# Altium schematic sheet Comparator.SchDoc
size A
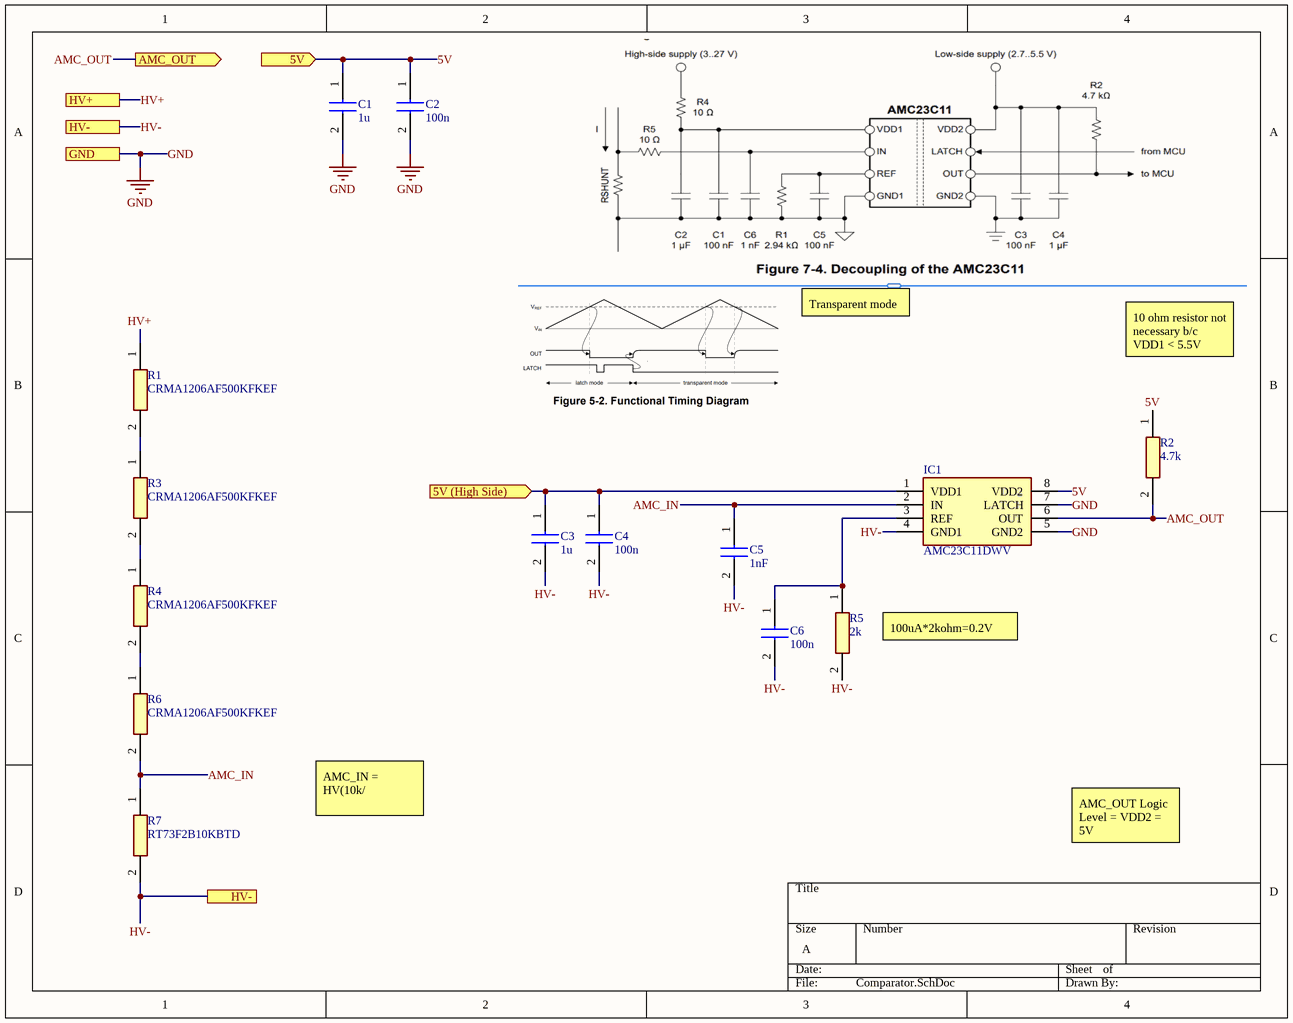
[diagram p0: Comparator.SchDoc]

## Parts
C1  1u  [CAPC2012X145N]
C2  100n  [CAPC2012X147N]
C3  1u  [CAPC2012X145N]
C4  100n  [CAPC2012X147N]
C5  1nF  [C1210]
C6  100n  [CAPC2012X147N]
IC1  AMC23C11DWV  [SOIC127P1150X280-8N]
R1  CRMA1206AF500KFKEF  [RESC3216X74N]
R2  4.7k  [RESC2012X65N]
R3  CRMA1206AF500KFKEF  [RESC3216X74N]
R4  CRMA1206AF500KFKEF  [RESC3216X74N]
R5  2k  [ERJP06D1000V]
R6  CRMA1206AF500KFKEF  [RESC3216X74N]
R7  RT73F2B10KBTD  [RESC3216X70N]

## Ports
5V (High Side) (in), 5V (in), AMC_OUT (out), GND, HV+, HV-

## Nets
GND: C1.2 C2.2 IC1.5(GND2) IC1.7(LATCH) ; port GND
5V: C1.1 C2.1 IC1.8(VDD2) R2.1 ; port 5V
5V (High Side): C3.1 C4.1 IC1.1(VDD1) ; port 5V (High Side)
AMC_IN: C5.1 IC1.2(IN) R6.2 R7.1
AMC_OUT: IC1.6(OUT) R2.2 ; port AMC_OUT
HV+: R1.1 ; port HV+
HV-: C3.2 C4.2 C5.2 C6.2 IC1.4(GND1) R5.2 R7.2 ; port HV-
NetC6_1: C6.1 IC1.3(REF) R5.1
NetR1_2: R1.2 R3.1
NetR3_2: R3.2 R4.1
NetR4_2: R4.2 R6.1

## Notes on the sheet
- Transparent mode
- 10 ohm resistor not necessary b/c VDD1 < 5.5V
- (near R5) 100uA*2kohm=0.2V
- AMC_IN = HV(10k/
- AMC_OUT Logic Level = VDD2 = 5V

## Library data of the parts
C1 C3 = KGM21AV51H105ZU: Capacitor; Manufacturer_Name: Kyocera AVX; Datasheet Link: https://www.mouser.com/datasheet/2/40/KGM_Y5V-3223189.pdf; Height: 1.45mm; Manufacturer_Part_Number: KGM21AV51H105ZU
C2 C4 C6 = KGF21BR71H104KT: Capacitor; Manufacturer_Name: Kyocera AVX; Datasheet Link: https://www.mouser.fr/datasheet/2/40/KGF-3223650.pdf; Height: 1.47mm; Manufacturer_Part_Number: KGF21BR71H104KT; Mouser Part Number: 581-KGF21BR71H104KT; Mouser Price/Stock: https://www.mouser.co.uk/ProductDetail/KYOCERA-AVX/KGF21BR71H104KT?qs=Jm2GQyTW%2FbjYyKCvVWAEOw%3D%3D; Arrow Part Number: KGF21BR71H104KT; Arrow Price/Stock: https://www.arrow.com/en/products/kgf21br71h104kt/avx?utm_currency=USD&region=nac
C5 = C1210C102JDGACAUTO: Capacitor; Manufacturer_Name: Yageo Group; Datasheet Link: https://www.yageogroup.com/content/datasheet/asset/file/KEM_C1080_C0G_HV_AUTO_SMD; Manufacturer_Part_Number: C1210C102JDGACAUTO; Mouser Part Number: 80-C1210C102JDGAUTO; Mouser Price/Stock: https://www.mouser.co.uk/ProductDetail/KEMET/C1210C102JDGACAUTO?qs=f9yNj16SXrIz1%252BjZlRLS%2FQ%3D%3D
IC1 = AMC23C11DWV: Integrated Circuit; Manufacturer_Name: Texas Instruments; Datasheet Link: https://www.ti.com/lit/ds/symlink/amc23c11.pdf; Height: 2.8mm; Manufacturer_Part_Number: AMC23C11DWV; Mouser Part Number: 595-AMC23C11DWV; Mouser Price/Stock: https://www.mouser.co.uk/ProductDetail/Texas-Instruments/AMC23C11DWV?qs=By6Nw2ByBD0b%2FD7l%2FEQWqQ%3D%3D; Arrow Part Number: AMC23C11DWV; Arrow Price/Stock: https://www.arrow.com/en/products/amc23c11dwv/texas-instruments?utm_currency=USD&region=nac
R1 R3 R4 R6 = CRMA1206AF500KFKEF: Resistor; Manufacturer_Name: Vishay; Datasheet Link: https://www.vishay.com/docs/68043/crma.pdf; Height: 0.74mm; Manufacturer_Part_Number: CRMA1206AF500KFKEF; Mouser Part Number: 71-CRMA1206AF500KFKF; Mouser Price/Stock: https://www.mouser.co.uk/ProductDetail/Vishay-Techno/CRMA1206AF500KFKEF?qs=1mbolxNpo8cDdncTsqghaQ%3D%3D; Arrow Part Number: CRMA1206AF500KFKEF; Arrow Price/Stock: https://www.arrow.com/en/products/crma1206af500kfkef/vishay?region=nac
R2 = CRG0805J4K7: Resistor; Manufacturer_Name: TE Connectivity; Datasheet Link: https://www.te.com/commerce/DocumentDelivery/DDEController?Action=srchrtrv&DocNm=1773204&DocType=Data%20Sheet&DocLang=English&PartCntxt=1623378-1&DocFormat=pdf; Height: 0.65mm; Manufacturer_Part_Number: CRG0805J4K7; Mouser Part Number: 279-CRG0805J4K7; Mouser Price/Stock: https://www.mouser.co.uk/ProductDetail/TE-Connectivity-Holsworthy/CRG0805J4K7?qs=8G8kQhBkhGgMmCk94lgNPw%3D%3D; Arrow Part Number: CRG0805J4K7; Arrow Price/Stock: https://www.arrow.com/en/products/crg0805j4k7/te-connectivity
R5 = ERJ-P06F2001V: Resistor; Manufacturer_Name: Panasonic; Datasheet Link: http://industrial.panasonic.com/cdbs/www-data/pdf/RDA0000/AOA0000C102.pdf; Height: 0.7mm; Manufacturer_Part_Number: ERJ-P06F2001V; Mouser Part Number: 667-ERJ-P06F2001V; Mouser Price/Stock: https://www.mouser.co.uk/ProductDetail/Panasonic/ERJ-P06F2001V?qs=iIVTEDlrHA33HmjCRTb3vw%3D%3D; Arrow Part Number: ERJ-P06F2001V; Arrow Price/Stock: https://www.arrow.com/en/products/erjp06f2001v/panasonic?region=nac
R7 = RT73F2B10KBTD: Resistor; Manufacturer_Name: TE Connectivity; Datasheet Link: https://www.te.com/commerce/DocumentDelivery/DDEController?Action=showdoc&DocId=Data+Sheet%7F1773450%7FA1%7Fpdf%7FEnglish%7FENG_DS_1773450_A1.pdf%7FCAT-F52-R; Height: 0.7mm; Manufacturer_Part_Number: RT73F2B10KBTD